# EAGLE design vga_breakout (EAGLE 9.0.0)
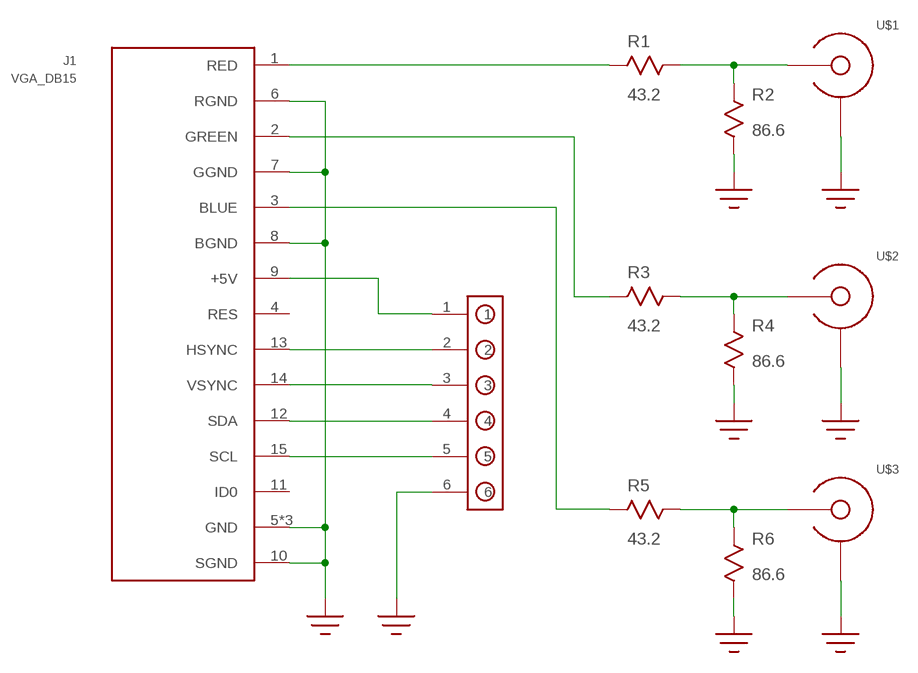
[diagram p0: schematic, sheet 1]

## Parts
J1  VGA_DB15  [VGA_PCB_MALE]
R1  43.2  R0805  [R0805]
R2  86.6  R0805  [R0805]
R3  43.2  R0805  [R0805]
R4  86.6  R0805  [R0805]
R5  43.2  R0805  [R0805]
R6  86.6  R0805  [R0805]
U$1  EDGE_LAUNCH_JACK  [EDGE_LAUNCH_RF_CON]
U$2  EDGE_LAUNCH_JACK  [EDGE_LAUNCH_RF_CON]
U$3  EDGE_LAUNCH_JACK  [EDGE_LAUNCH_RF_CON]
U$9  HEADER_6P  [HEADER_6P]

## Nets
+5V: J1.9(+5V) U$9.1
BLUE [75ohm]: J1.3(BLUE) R5.P$2
GND: J1.5(GND) J1.6(RGND) J1.7(GGND) J1.8(BGND) J1.10(SGND) J1.TAB@1(GND) J1.TAB@2(GND) R2.P$2 R4.P$1 R6.P$2 U$1.GND@1(SHIELD) U$1.GND@2(SHIELD) U$1.GND@3(SHIELD) U$1.GND@4(SHIELD) U$1.GND@5(SHIELD) U$1.GND@6(SHIELD) U$1.GND@7(SHIELD) U$1.GND@8(SHIELD) U$1.GND@9(SHIELD) U$1.GND@10(SHIELD) U$1.GND@11(SHIELD) U$1.GND@12(SHIELD) U$1.SHIELD@1(SHIELD) U$1.SHIELD@2(SHIELD) U$2.GND@1(SHIELD) U$2.GND@2(SHIELD) U$2.GND@3(SHIELD) U$2.GND@4(SHIELD) U$2.GND@5(SHIELD) U$2.GND@6(SHIELD) U$2.GND@7(SHIELD) U$2.GND@8(SHIELD) U$2.GND@9(SHIELD) U$2.GND@10(SHIELD) U$2.GND@11(SHIELD) U$2.GND@12(SHIELD) U$2.SHIELD@1(SHIELD) U$2.SHIELD@2(SHIELD) U$3.GND@1(SHIELD) U$3.GND@2(SHIELD) U$3.GND@3(SHIELD) U$3.GND@4(SHIELD) U$3.GND@5(SHIELD) U$3.GND@6(SHIELD) U$3.GND@7(SHIELD) U$3.GND@8(SHIELD) U$3.GND@9(SHIELD) U$3.GND@10(SHIELD) U$3.GND@11(SHIELD) U$3.GND@12(SHIELD) U$3.SHIELD@1(SHIELD) U$3.SHIELD@2(SHIELD) U$9.6
GREEN [75ohm]: J1.2(GREEN) R3.P$2
HSYNC: J1.13(HSYNC) U$9.2
N$1: R5.P$1 R6.P$1 U$3.CENTER
N$2 [50ohm]: R3.P$1 R4.P$2 U$2.CENTER
N$3 [50ohm]: R1.P$2 R2.P$1 U$1.CENTER
RED [75ohm]: J1.1(RED) R1.P$1
SCL: J1.15(SCL) U$9.5
SDA: J1.12(SDA) U$9.4
VSYNC: J1.14(VSYNC) U$9.3
Unconnected: J1.4(RES) J1.11(ID0)

## Library data of the parts
J1 = mw-voice-marker:VGA_DB15
R1-R6 = mw-voice-marker:R
U$1-U$3 = mw-voice-marker:EDGE_LAUNCH_JACK
U$9 = mw-voice-marker:HEADER_6P

## Net classes
1 50ohm: width 1.041 mm, clearance 0.203 mm
2 75ohm: width 0.203 mm, clearance 0.152 mm

## Board
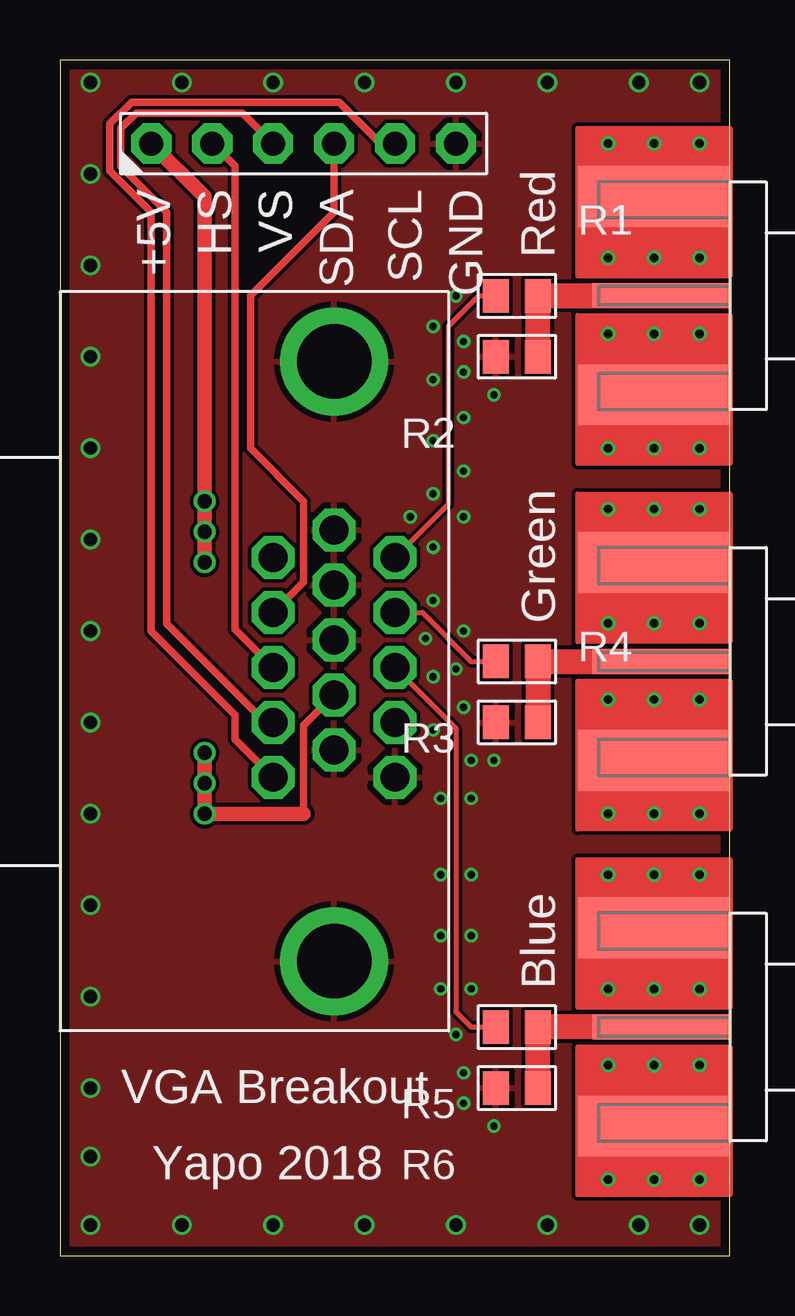
[diagram p1: board, top side]
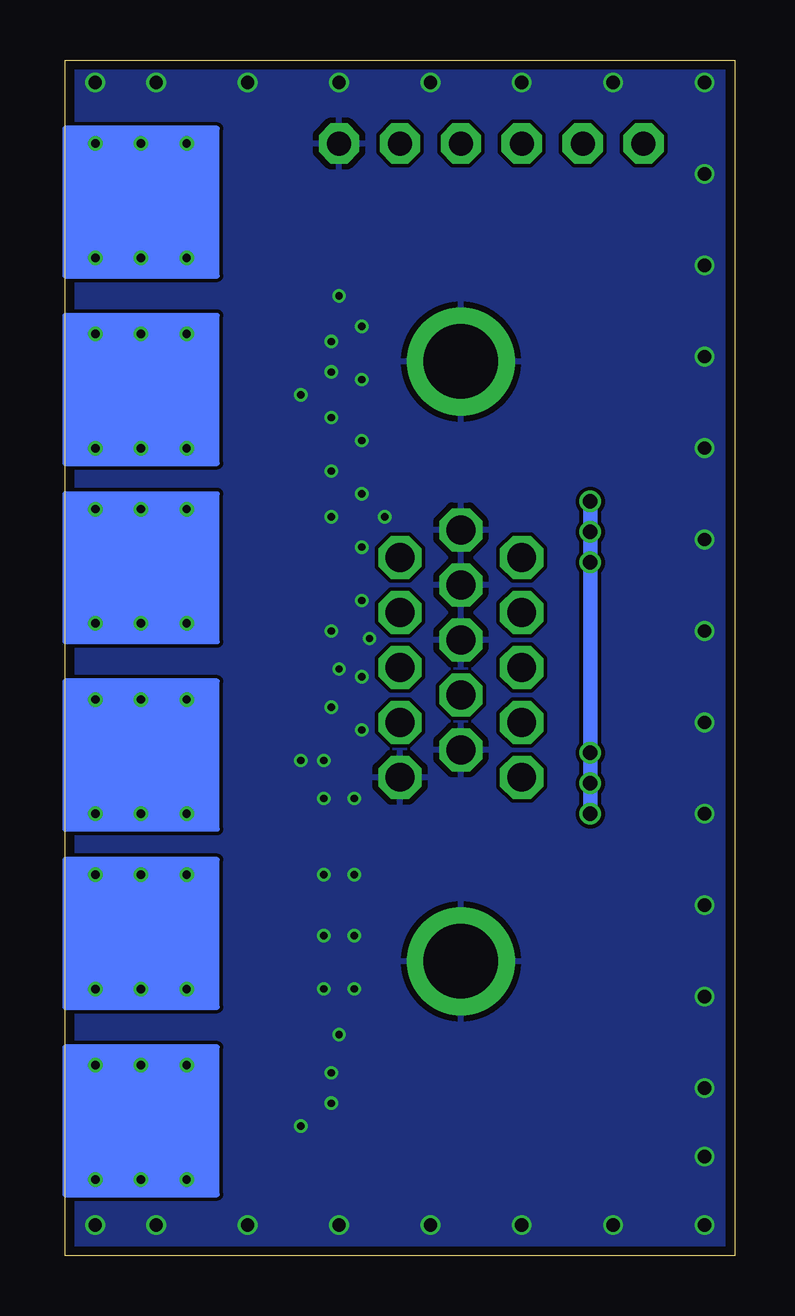
[diagram p2: board, bottom side, seen from below]

Size 27.92 x 49.84 mm. Coordinates in mm from the lower left corner, seen from the top.
Outline: 0,0 27.92,0 27.92,49.84 0,49.84 0,0
Copper layers (1*16): Top 0.035559375mm / dielectric 1.6mm / Bottom 0.035559375mm
Design rules "oshpark-2layer *": minimum track width 6mil, minimum drill 10mil, track to track 6mil, track to pad 6mil, pad to pad 6mil, via to via 6mil, smd to smd 6mil, copper to edge 15mil, drill to drill 6mil, minimum pad ring 5mil, minimum via ring 5mil, stop-mask expansion 2.5mil, vias tented up to drill 25mil, thermal gap 10mil

### Footprints (pad centres in the part's own frame; a part is rotated, then mirrored left to right if it is on the bottom)
VGA_PCB_MALE = drill 1.2 octagon: 1 -4.33,2.54; 2 -2.04,2.54; 3 0.25,2.54; 4 2.54,2.54; 5 4.83,2.54; 6 -5.475,0; 7 -3.185,0; 8 -0.895,0; 9 1.395,0; 10 3.685,0; 11 -4.33,-2.54; 12 -2.04,-2.54; 13 0.25,-2.54; 14 2.54,-2.54; 15 4.83,-2.54 | drill 3.1 pad 4.5: TAB@1 -12.5,0; TAB@2 12.5,0
R0805 = smd 1.1 x 1.4: P$1 -0.875,0; P$2 0.875,0
EDGE_LAUNCH_RF_CON = smd 5.715 x 1.041: CENTER -2.875,0 | drill 0.35: GND@1 -5.08,1.587; GND@2 -3.175,1.587; GND@3 -1.27,1.587; GND@4 -5.08,-1.587; GND@5 -3.175,-1.587; GND@6 -1.27,-1.587; GND@7 -5.08,6.35; GND@8 -3.175,6.35; GND@9 -1.27,6.35; GND@10 -5.08,-6.35; GND@11 -3.175,-6.35; GND@12 -1.27,-6.35 | smd 6.35 x 2.54: SHIELD@1 -3.175,-4.128; SHIELD@2 -3.175,4.128
HEADER_6P = drill 1 pad 1.676 octagon: 1 -6.35,0; 2 -3.81,0; 3 -1.27,0; 4 1.27,0; 5 3.81,0; 6 6.35,0

### Placement (x,y rotation side)
J1  11.43,24.77 270 top
R1  19.05,40.01 0 top
R2  19.05,37.47 180 top
R3  19.05,24.77 180 top
R4  19.05,22.23 0 top
R5  19.05,9.53 180 top
R6  19.05,6.99 180 top
U$1  27.94,40.01 0 top
U$2  27.94,24.77 0 top
U$3  27.94,9.53 0 top
U$9  10.16,46.35 0 top

### Tracks (layer width: path | path; a pad name or v marks a point on that pad's centre or on a via)
+5V  (via drill 0.6)
  Top 0.305: J1.9 10.16,22.1 10.16,18.41
  Top 0.61: 10.16,18.41 v6.03,18.41 v6.03,19.68 v6.03,20.95 | v6.03,28.89 v6.03,30.16 v6.03,31.43 6.03,44.13 U$9.1
  Bottom 0.61: v6.03,18.41 v6.03,28.89 v6.03,31.43
BLUE
  Top 0.203: J1.3 16.51,21.98 16.51,10.16 17.14,9.53 R5.P$2
GND  (via drill 0.3, 0.55)
  other vias: 1.27,1.27 5.08,1.27 8.89,1.27 12.7,1.27 16.51,1.27 20.32,1.27 24.13,1.27 1.27,4.13 1.27,6.99 1.27,10.79 1.27,14.61 1.27,18.41 1.27,22.23 1.27,26.04 1.27,29.84 1.27,33.66 1.27,37.47 1.27,41.27 1.27,45.09 1.27,48.9 5.08,48.9 8.89,48.9 12.7,48.9 16.51,48.9 20.32,48.9 24.13,48.9 26.67,48.9 26.67,1.27 18.1,20.64 15.56,27.3 15.24,25.72 16.83,26.04 16.51,24.45 16.83,22.86 15.56,24.13 15.56,21.91 15.88,19.05 17.14,19.05 17.14,15.88 15.88,15.88 15.88,13.34 17.14,13.34 15.88,11.11 17.14,11.11 16.51,9.21 17.14,20.64 16.83,7.62 16.83,6.35 18.1,5.4 16.83,36.83 16.83,38.1 15.56,29.53 14.61,30.8 15.56,31.75 16.83,30.8 16.83,32.7 15.56,33.97 16.83,34.92 15.56,36.51 15.56,38.73 16.51,40.01 18.1,35.88
  pour Top: 0,0 27.94,0 27.94,50.16 0,50.16
  pour Bottom: 0,0 27.94,0 27.94,50.16 0,50.16
GREEN
  Top 0.203: 18.18,25.14 R3.P$2 17.14,24.77 15.11,26.8 J1.2
HSYNC
  Top 0.305: J1.13 7.3,26.1 7.3,45.4 U$9.2
N$1
  Top 1.041: U$3.CENTER R5.P$1 R6.P$1
N$2
  Top 1.041: U$2.CENTER R3.P$1 R4.P$2
N$3
  Top 1.041: U$1.CENTER R1.P$2 R2.P$1
RED
  Top 0.203: J1.1 16.19,31.32 16.19,38.73 17.46,40.01 R1.P$1
SCL
  Top 0.305: U$9.5 13.36,46.35 11.64,48.08 2.99,48.08 2.08,47.18 2.08,45.21 3.81,43.49 3.81,26.04 7.3,22.54 7.3,21.52 J1.15
SDA
  Top 0.305: U$9.4 11.43,43.5 7.94,40.01 7.94,33.66 10.16,31.43 10.16,28.07 J1.12
VSYNC
  Top 0.305: U$9.3 7.62,47.62 3.17,47.62 2.54,46.99 2.54,45.4 4.45,43.5 4.45,26.35 8.57,22.23 J1.14

### Text on the board
tPlace: +5V | HS | VS | SDA | SCL | GND | Red | Green | Blue | VGA Breakout | Yapo 2018